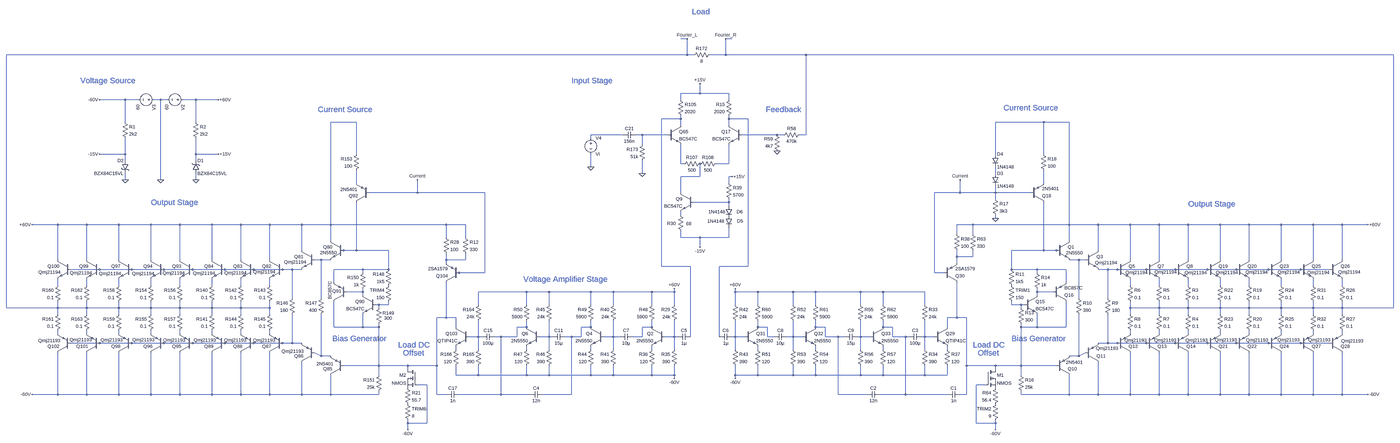
[diagram p0: schematic paltkz - Copy.asc, whole sheet]
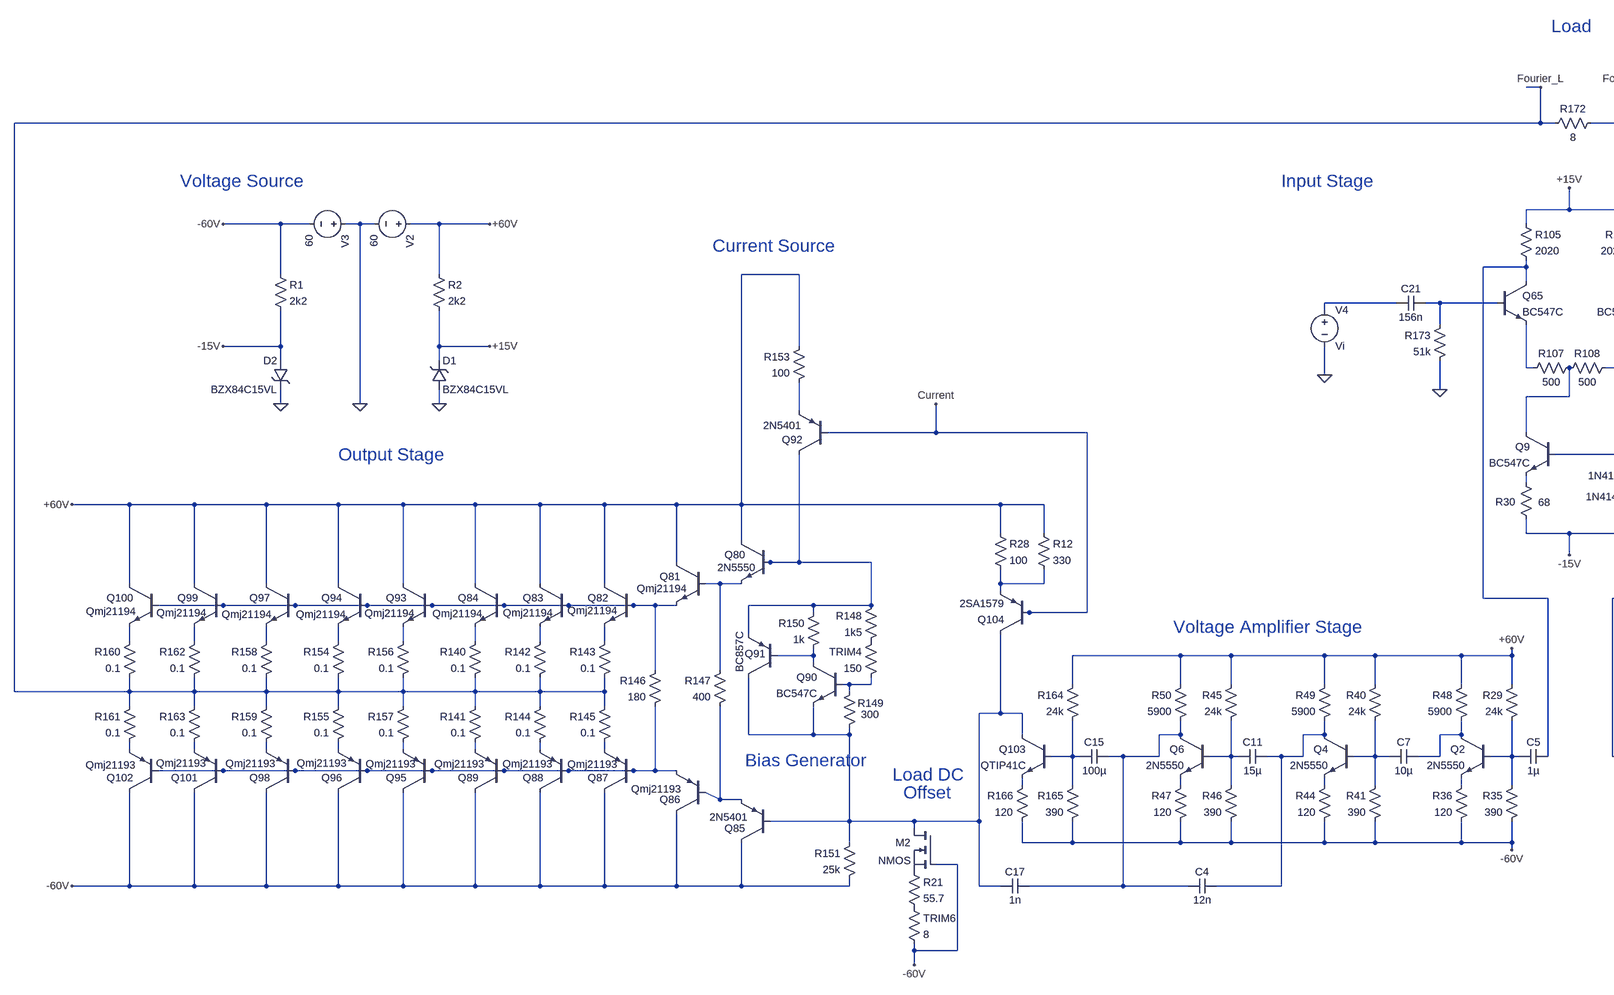
[diagram p1: schematic paltkz - Copy.asc, part, row 1 of 1, column 1 of 2]
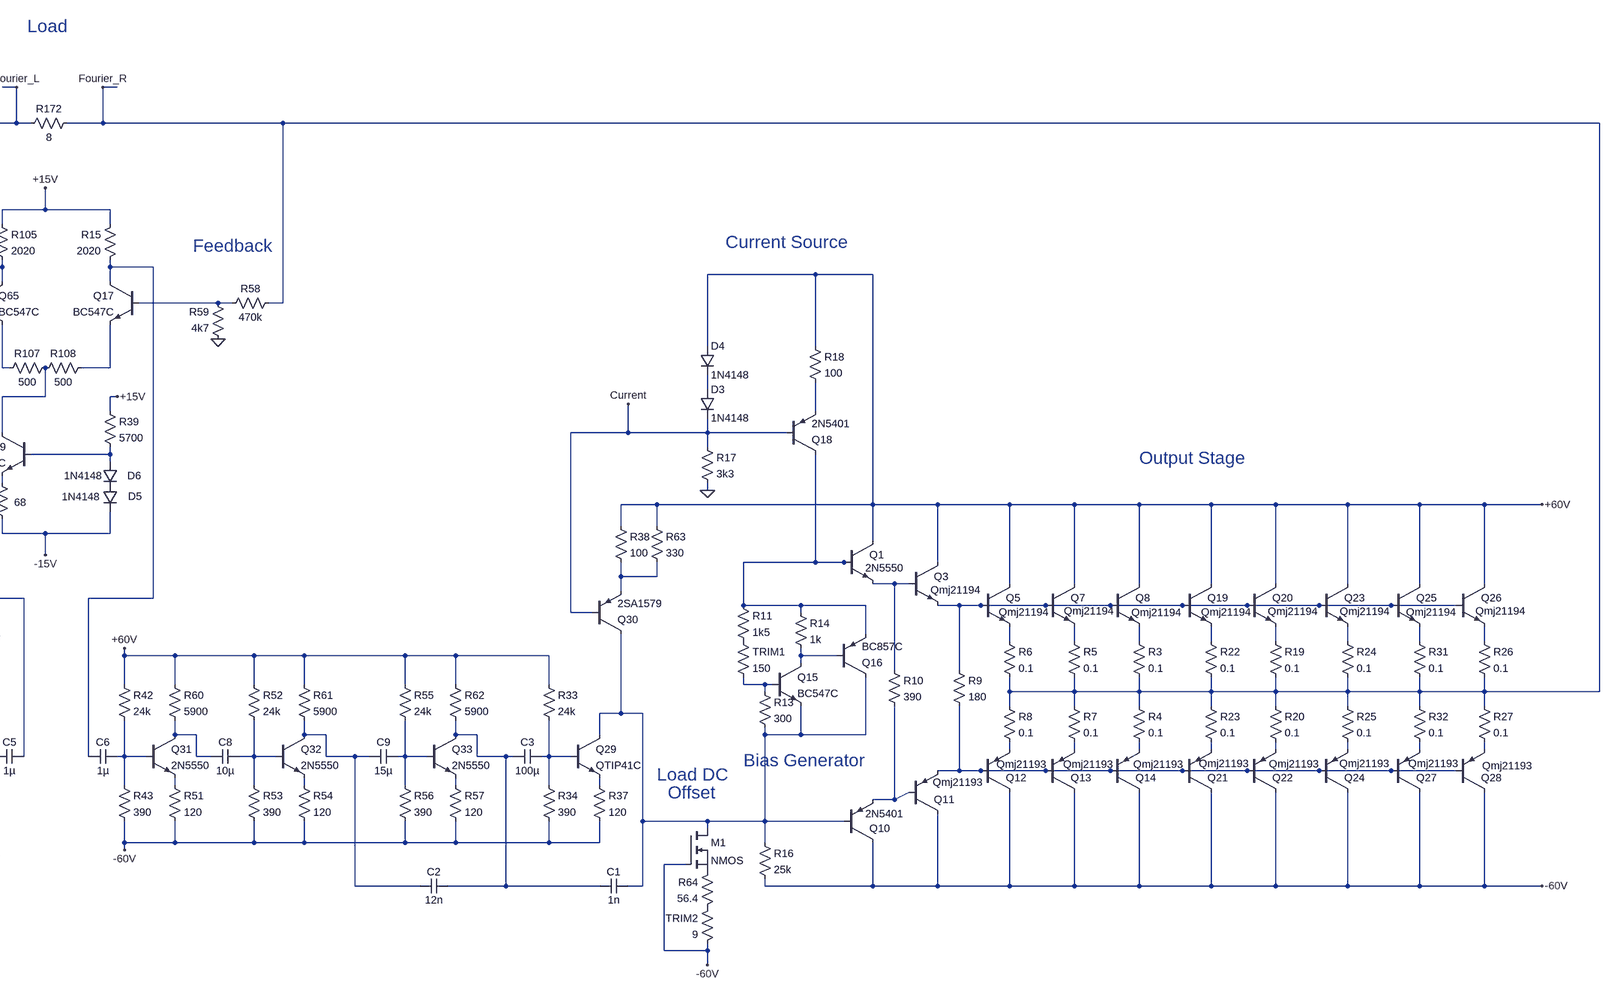
[diagram p2: schematic paltkz - Copy.asc, part, row 1 of 1, column 2 of 2]
paltkz - Copy.asc, the LTspice schematic file:
Version 4
SHEET 1 16980 7664
WIRE 7696 4128 7664 4128
WIRE 7920 4128 7888 4128
WIRE 7696 4208 7696 4128
WIRE 7696 4208 4304 4208
WIRE 7728 4208 7696 4208
WIRE 7888 4208 7888 4128
WIRE 7888 4208 7808 4208
WIRE 8288 4208 7888 4208
WIRE 11216 4208 8288 4208
WIRE 7760 4400 7760 4352
WIRE 7760 4400 7664 4400
WIRE 7904 4400 7760 4400
WIRE 4896 4432 4768 4432
WIRE 4960 4432 4896 4432
WIRE 5072 4432 5040 4432
WIRE 5104 4432 5072 4432
WIRE 5248 4432 5184 4432
WIRE 5360 4432 5248 4432
WIRE 7664 4432 7664 4400
WIRE 7904 4432 7904 4400
WIRE 7664 4528 7664 4512
WIRE 7664 4528 7568 4528
WIRE 7904 4528 7904 4512
WIRE 8000 4528 7904 4528
WIRE 4896 4544 4896 4432
WIRE 5248 4544 5248 4432
WIRE 6048 4544 5920 4544
WIRE 9472 4544 9232 4544
WIRE 9600 4544 9472 4544
WIRE 7664 4560 7664 4528
WIRE 7904 4560 7904 4528
WIRE 7376 4608 7216 4608
WIRE 7472 4608 7440 4608
WIRE 7600 4608 7472 4608
WIRE 8144 4608 7968 4608
WIRE 8176 4608 8144 4608
WIRE 8288 4608 8288 4208
WIRE 8288 4608 8256 4608
WIRE 7216 4624 7216 4608
WIRE 7472 4656 7472 4608
WIRE 4896 4704 4896 4624
WIRE 4896 4704 4768 4704
WIRE 5248 4704 5248 4624
WIRE 5360 4704 5248 4704
WIRE 6048 4704 6048 4544
WIRE 9232 4704 9232 4544
WIRE 9472 4704 9472 4544
WIRE 4896 4736 4896 4704
WIRE 5248 4736 5248 4704
WIRE 7664 4752 7664 4656
WIRE 7680 4752 7664 4752
WIRE 7904 4752 7904 4656
WIRE 7904 4752 7840 4752
WIRE 7216 4768 7216 4704
WIRE 7472 4800 7472 4736
WIRE 9232 4800 9232 4768
WIRE 7760 4816 7760 4752
WIRE 7760 4816 7664 4816
WIRE 7920 4816 7904 4816
WIRE 4896 4832 4896 4800
WIRE 5072 4832 5072 4432
WIRE 5248 4832 5248 4800
WIRE 6048 4848 6048 4784
WIRE 7904 4848 7904 4816
WIRE 9472 4848 9472 4784
WIRE 6352 4896 6352 4832
WIRE 6352 4896 6112 4896
WIRE 6688 4896 6352 4896
WIRE 7664 4896 7664 4816
WIRE 9056 4896 9056 4832
WIRE 9056 4896 8928 4896
WIRE 9232 4896 9232 4864
WIRE 9232 4896 9056 4896
WIRE 9408 4896 9232 4896
WIRE 9232 4928 9232 4896
WIRE 7904 4944 7904 4928
WIRE 7904 4944 7728 4944
WIRE 7904 4960 7904 4944
WIRE 7664 5008 7664 4992
WIRE 7904 5024 7904 5008
WIRE 9232 5024 9232 5008
WIRE 4560 5056 4432 5056
WIRE 4704 5056 4560 5056
WIRE 4864 5056 4704 5056
WIRE 5024 5056 4864 5056
WIRE 5168 5056 5024 5056
WIRE 5328 5056 5168 5056
WIRE 5472 5056 5328 5056
WIRE 5616 5056 5472 5056
WIRE 5776 5056 5616 5056
WIRE 5920 5056 5920 4544
WIRE 5920 5056 5776 5056
WIRE 6496 5056 5920 5056
WIRE 6592 5056 6496 5056
WIRE 9120 5056 9040 5056
WIRE 9600 5056 9600 4544
WIRE 9600 5056 9120 5056
WIRE 9744 5056 9600 5056
WIRE 9904 5056 9744 5056
WIRE 10048 5056 9904 5056
WIRE 10192 5056 10048 5056
WIRE 10352 5056 10192 5056
WIRE 10496 5056 10352 5056
WIRE 10656 5056 10496 5056
WIRE 10816 5056 10656 5056
WIRE 10960 5056 10816 5056
WIRE 11088 5056 10960 5056
WIRE 9040 5104 9040 5056
WIRE 9120 5104 9120 5056
WIRE 6496 5120 6496 5056
WIRE 6592 5120 6592 5056
WIRE 7664 5120 7664 5088
WIRE 7760 5120 7664 5120
WIRE 7904 5120 7904 5072
WIRE 7904 5120 7760 5120
WIRE 5920 5136 5920 5056
WIRE 9600 5136 9600 5056
WIRE 7760 5168 7760 5120
WIRE 5776 5184 5776 5056
WIRE 5984 5184 5968 5184
WIRE 6048 5184 6048 4944
WIRE 6048 5184 5984 5184
WIRE 6208 5184 6048 5184
WIRE 9472 5184 9472 4944
WIRE 9472 5184 9312 5184
WIRE 9536 5184 9472 5184
WIRE 9552 5184 9536 5184
WIRE 9744 5184 9744 5056
WIRE 9040 5216 9040 5184
WIRE 9120 5216 9120 5184
WIRE 9120 5216 9040 5216
WIRE 4560 5232 4560 5056
WIRE 4704 5232 4704 5056
WIRE 4864 5232 4864 5056
WIRE 5024 5232 5024 5056
WIRE 5168 5232 5168 5056
WIRE 5328 5232 5328 5056
WIRE 5472 5232 5472 5056
WIRE 5616 5232 5616 5056
WIRE 5872 5232 5840 5232
WIRE 5920 5232 5872 5232
WIRE 6496 5232 6496 5200
WIRE 6592 5232 6592 5200
WIRE 6592 5232 6496 5232
WIRE 9648 5232 9600 5232
WIRE 9680 5232 9648 5232
WIRE 9904 5232 9904 5056
WIRE 10048 5232 10048 5056
WIRE 10192 5232 10192 5056
WIRE 10352 5232 10352 5056
WIRE 10496 5232 10496 5056
WIRE 10656 5232 10656 5056
WIRE 10816 5232 10816 5056
WIRE 10960 5232 10960 5056
WIRE 6496 5248 6496 5232
WIRE 9040 5248 9040 5216
WIRE 7568 5264 7568 4528
WIRE 7712 5264 7568 5264
WIRE 8000 5264 8000 4528
WIRE 8000 5264 7856 5264
WIRE 4768 5280 4624 5280
WIRE 4928 5280 4768 5280
WIRE 5088 5280 4928 5280
WIRE 5232 5280 5088 5280
WIRE 5392 5280 5232 5280
WIRE 5536 5280 5392 5280
WIRE 5680 5280 5536 5280
WIRE 5728 5280 5680 5280
WIRE 5776 5280 5728 5280
WIRE 6080 5280 5936 5280
WIRE 6208 5280 6208 5184
WIRE 6208 5280 6080 5280
WIRE 9312 5280 9312 5184
WIRE 9440 5280 9312 5280
WIRE 9584 5280 9440 5280
WIRE 9792 5280 9744 5280
WIRE 9840 5280 9792 5280
WIRE 9984 5280 9840 5280
WIRE 10128 5280 9984 5280
WIRE 10288 5280 10128 5280
WIRE 10432 5280 10288 5280
WIRE 10592 5280 10432 5280
WIRE 10752 5280 10592 5280
WIRE 10896 5280 10752 5280
WIRE 6080 5296 6080 5280
WIRE 6560 5296 6544 5296
WIRE 6688 5296 6688 4896
WIRE 6688 5296 6560 5296
WIRE 8928 5296 8928 4896
WIRE 8976 5296 8928 5296
WIRE 9440 5296 9440 5280
WIRE 5936 5344 5936 5280
WIRE 9584 5344 9584 5280
WIRE 4560 5360 4560 5328
WIRE 4704 5360 4704 5328
WIRE 4864 5360 4864 5328
WIRE 5024 5360 5024 5328
WIRE 5168 5360 5168 5328
WIRE 5328 5360 5328 5328
WIRE 5472 5360 5472 5328
WIRE 5616 5360 5616 5328
WIRE 9904 5360 9904 5328
WIRE 10048 5360 10048 5328
WIRE 10192 5360 10192 5328
WIRE 10352 5360 10352 5328
WIRE 10496 5360 10496 5328
WIRE 10656 5360 10656 5328
WIRE 10816 5360 10816 5328
WIRE 10960 5360 10960 5328
WIRE 6080 5392 6080 5376
WIRE 6080 5392 6000 5392
WIRE 6896 5392 6656 5392
WIRE 7008 5392 6896 5392
WIRE 7216 5392 7008 5392
WIRE 7328 5392 7216 5392
WIRE 7520 5392 7328 5392
WIRE 7632 5392 7632 5376
WIRE 7632 5392 7520 5392
WIRE 7936 5392 7936 5376
WIRE 8048 5392 7936 5392
WIRE 8224 5392 8048 5392
WIRE 8336 5392 8224 5392
WIRE 8560 5392 8336 5392
WIRE 8672 5392 8560 5392
WIRE 8880 5392 8672 5392
WIRE 9440 5392 9440 5376
WIRE 9520 5392 9440 5392
WIRE 6080 5408 6080 5392
WIRE 9440 5408 9440 5392
WIRE 5728 5424 5728 5280
WIRE 5872 5424 5872 5232
WIRE 9648 5424 9648 5232
WIRE 9792 5424 9792 5280
WIRE 6160 5456 6144 5456
WIRE 6208 5456 6208 5440
WIRE 6208 5456 6160 5456
WIRE 6656 5456 6656 5392
WIRE 6896 5456 6896 5392
WIRE 7008 5456 7008 5392
WIRE 7216 5456 7216 5392
WIRE 7328 5456 7328 5392
WIRE 7520 5456 7520 5392
WIRE 7632 5456 7632 5392
WIRE 7936 5456 7936 5392
WIRE 8048 5456 8048 5392
WIRE 8224 5456 8224 5392
WIRE 8336 5456 8336 5392
WIRE 8560 5456 8560 5392
WIRE 8672 5456 8672 5392
WIRE 8880 5456 8880 5392
WIRE 9312 5456 9312 5440
WIRE 9360 5456 9312 5456
WIRE 9376 5456 9360 5456
WIRE 4304 5472 4304 4208
WIRE 4560 5472 4560 5440
WIRE 4560 5472 4304 5472
WIRE 4704 5472 4704 5440
WIRE 4704 5472 4560 5472
WIRE 4864 5472 4864 5440
WIRE 4864 5472 4704 5472
WIRE 5024 5472 5024 5440
WIRE 5024 5472 4864 5472
WIRE 5168 5472 5168 5440
WIRE 5168 5472 5024 5472
WIRE 5328 5472 5328 5440
WIRE 5328 5472 5168 5472
WIRE 5472 5472 5472 5440
WIRE 5472 5472 5328 5472
WIRE 5616 5472 5616 5440
WIRE 5616 5472 5472 5472
WIRE 6160 5472 6160 5456
WIRE 9360 5472 9360 5456
WIRE 9904 5472 9904 5440
WIRE 10048 5472 10048 5440
WIRE 10048 5472 9904 5472
WIRE 10192 5472 10192 5440
WIRE 10192 5472 10048 5472
WIRE 10352 5472 10352 5440
WIRE 10352 5472 10192 5472
WIRE 10496 5472 10496 5440
WIRE 10496 5472 10352 5472
WIRE 10656 5472 10656 5440
WIRE 10656 5472 10496 5472
WIRE 10816 5472 10816 5440
WIRE 10816 5472 10656 5472
WIRE 10960 5472 10960 5440
WIRE 10960 5472 10816 5472
WIRE 11216 5472 11216 4208
WIRE 11216 5472 10960 5472
WIRE 4560 5504 4560 5472
WIRE 4704 5504 4704 5472
WIRE 4864 5504 4864 5472
WIRE 5024 5504 5024 5472
WIRE 5168 5504 5168 5472
WIRE 5328 5504 5328 5472
WIRE 5472 5504 5472 5472
WIRE 5616 5504 5616 5472
WIRE 9904 5504 9904 5472
WIRE 10048 5504 10048 5472
WIRE 10192 5504 10192 5472
WIRE 10352 5504 10352 5472
WIRE 10496 5504 10496 5472
WIRE 10656 5504 10656 5472
WIRE 10816 5504 10816 5472
WIRE 10960 5504 10960 5472
WIRE 6496 5520 6496 5344
WIRE 6496 5520 6448 5520
WIRE 6544 5520 6496 5520
WIRE 9040 5520 9040 5344
WIRE 9040 5520 8992 5520
WIRE 9088 5520 9040 5520
WIRE 5936 5568 5936 5440
WIRE 6080 5568 6080 5504
WIRE 6080 5568 5936 5568
WIRE 6160 5568 6160 5552
WIRE 6160 5568 6080 5568
WIRE 6544 5568 6544 5520
WIRE 6896 5568 6896 5536
WIRE 6896 5568 6848 5568
WIRE 7216 5568 7216 5536
WIRE 7216 5568 7168 5568
WIRE 7520 5568 7520 5536
WIRE 7520 5568 7472 5568
WIRE 8048 5568 8048 5536
WIRE 8096 5568 8048 5568
WIRE 8336 5568 8336 5536
WIRE 8384 5568 8336 5568
WIRE 8672 5568 8672 5536
WIRE 8720 5568 8672 5568
WIRE 8992 5568 8992 5520
WIRE 9360 5568 9360 5552
WIRE 9440 5568 9440 5504
WIRE 9440 5568 9360 5568
WIRE 9584 5568 9584 5440
WIRE 9584 5568 9440 5568
WIRE 4560 5600 4560 5584
WIRE 4704 5600 4704 5584
WIRE 4864 5600 4864 5584
WIRE 5024 5600 5024 5584
WIRE 5168 5600 5168 5584
WIRE 5328 5600 5328 5584
WIRE 5472 5600 5472 5584
WIRE 5616 5600 5616 5584
WIRE 9904 5600 9904 5584
WIRE 10048 5600 10048 5584
WIRE 10192 5600 10192 5584
WIRE 10352 5600 10352 5584
WIRE 10496 5600 10496 5584
WIRE 10656 5600 10656 5584
WIRE 10816 5600 10816 5584
WIRE 10960 5600 10960 5584
WIRE 6656 5616 6656 5536
WIRE 6656 5616 6608 5616
WIRE 6672 5616 6656 5616
WIRE 6768 5616 6736 5616
WIRE 6848 5616 6848 5568
WIRE 6848 5616 6768 5616
WIRE 7008 5616 7008 5536
WIRE 7008 5616 6960 5616
WIRE 7024 5616 7008 5616
WIRE 7120 5616 7088 5616
WIRE 7168 5616 7168 5568
WIRE 7168 5616 7120 5616
WIRE 7328 5616 7328 5536
WIRE 7328 5616 7280 5616
WIRE 7360 5616 7328 5616
WIRE 7472 5616 7472 5568
WIRE 7472 5616 7424 5616
WIRE 7632 5616 7632 5536
WIRE 7632 5616 7584 5616
WIRE 7648 5616 7632 5616
WIRE 7712 5616 7712 5264
WIRE 7856 5616 7856 5264
WIRE 7936 5616 7936 5536
WIRE 7936 5616 7920 5616
WIRE 7984 5616 7936 5616
WIRE 8096 5616 8096 5568
WIRE 8128 5616 8096 5616
WIRE 8224 5616 8224 5536
WIRE 8224 5616 8192 5616
WIRE 8272 5616 8224 5616
WIRE 8384 5616 8384 5568
WIRE 8448 5616 8384 5616
WIRE 8480 5616 8448 5616
WIRE 8560 5616 8560 5536
WIRE 8560 5616 8544 5616
WIRE 8608 5616 8560 5616
WIRE 8720 5616 8720 5568
WIRE 8784 5616 8720 5616
WIRE 8800 5616 8784 5616
WIRE 8880 5616 8880 5536
WIRE 8880 5616 8864 5616
WIRE 8928 5616 8880 5616
WIRE 4768 5648 4624 5648
WIRE 4928 5648 4768 5648
WIRE 5088 5648 4928 5648
WIRE 5232 5648 5088 5648
WIRE 5392 5648 5232 5648
WIRE 5536 5648 5392 5648
WIRE 5680 5648 5536 5648
WIRE 5728 5648 5728 5504
WIRE 5728 5648 5680 5648
WIRE 5776 5648 5728 5648
WIRE 9792 5648 9792 5504
WIRE 9792 5648 9744 5648
WIRE 9840 5648 9792 5648
WIRE 9984 5648 9840 5648
WIRE 10128 5648 9984 5648
WIRE 10288 5648 10128 5648
WIRE 10432 5648 10288 5648
WIRE 10592 5648 10432 5648
WIRE 10752 5648 10592 5648
WIRE 10896 5648 10752 5648
WIRE 6544 5680 6544 5664
WIRE 6656 5680 6656 5616
WIRE 6896 5680 6896 5664
WIRE 7008 5680 7008 5616
WIRE 7216 5680 7216 5664
WIRE 7328 5680 7328 5616
WIRE 7520 5680 7520 5664
WIRE 7632 5680 7632 5616
WIRE 7936 5680 7936 5616
WIRE 8048 5680 8048 5664
WIRE 8224 5680 8224 5616
WIRE 8336 5680 8336 5664
WIRE 8560 5680 8560 5616
WIRE 8672 5680 8672 5664
WIRE 8880 5680 8880 5616
WIRE 8992 5680 8992 5664
WIRE 5872 5712 5872 5504
WIRE 5872 5712 5840 5696
WIRE 5920 5712 5872 5712
WIRE 9648 5712 9648 5504
WIRE 9648 5712 9680 5696
WIRE 9648 5712 9600 5712
WIRE 6160 5760 6160 5568
WIRE 6160 5760 5984 5760
WIRE 6304 5760 6160 5760
WIRE 6448 5760 6448 5520
WIRE 6448 5760 6304 5760
WIRE 9088 5760 9088 5520
WIRE 9232 5760 9088 5760
WIRE 9360 5760 9360 5568
WIRE 9360 5760 9232 5760
WIRE 9536 5760 9360 5760
WIRE 6304 5776 6304 5760
WIRE 9232 5776 9232 5760
WIRE 6160 5808 6160 5760
WIRE 6544 5808 6544 5760
WIRE 6656 5808 6656 5760
WIRE 6656 5808 6544 5808
WIRE 6896 5808 6896 5760
WIRE 6896 5808 6656 5808
WIRE 7008 5808 7008 5760
WIRE 7008 5808 6896 5808
WIRE 7216 5808 7216 5760
WIRE 7216 5808 7008 5808
WIRE 7328 5808 7328 5760
WIRE 7328 5808 7216 5808
WIRE 7520 5808 7520 5760
WIRE 7520 5808 7328 5808
WIRE 7632 5808 7632 5760
WIRE 7632 5808 7520 5808
WIRE 7936 5808 7936 5760
WIRE 8048 5808 8048 5760
WIRE 8048 5808 7936 5808
WIRE 8224 5808 8224 5760
WIRE 8224 5808 8048 5808
WIRE 8336 5808 8336 5760
WIRE 8336 5808 8224 5808
WIRE 8560 5808 8560 5760
WIRE 8560 5808 8336 5808
WIRE 8672 5808 8672 5760
WIRE 8672 5808 8560 5808
WIRE 8880 5808 8880 5760
WIRE 8880 5808 8672 5808
WIRE 8992 5808 8992 5760
WIRE 8992 5808 8880 5808
WIRE 9360 5808 9360 5760
WIRE 7632 5824 7632 5808
WIRE 7936 5824 7936 5808
WIRE 6400 5856 6352 5856
WIRE 9184 5856 9136 5856
WIRE 4560 5904 4560 5696
WIRE 4560 5904 4432 5904
WIRE 4704 5904 4704 5696
WIRE 4704 5904 4560 5904
WIRE 4864 5904 4864 5696
WIRE 4864 5904 4704 5904
WIRE 5024 5904 5024 5696
WIRE 5024 5904 4864 5904
WIRE 5168 5904 5168 5696
WIRE 5168 5904 5024 5904
WIRE 5328 5904 5328 5696
WIRE 5328 5904 5168 5904
WIRE 5472 5904 5472 5696
WIRE 5472 5904 5328 5904
WIRE 5616 5904 5616 5696
WIRE 5616 5904 5472 5904
WIRE 5776 5904 5776 5744
WIRE 5776 5904 5616 5904
WIRE 5920 5904 5920 5808
WIRE 5920 5904 5776 5904
WIRE 6160 5904 6160 5888
WIRE 6160 5904 5920 5904
WIRE 6448 5904 6448 5760
WIRE 6496 5904 6448 5904
WIRE 6768 5904 6768 5616
WIRE 6768 5904 6560 5904
WIRE 6912 5904 6768 5904
WIRE 7120 5904 7120 5616
WIRE 7120 5904 6976 5904
WIRE 8448 5904 8448 5616
WIRE 8592 5904 8448 5904
WIRE 8784 5904 8784 5616
WIRE 8784 5904 8656 5904
WIRE 8992 5904 8784 5904
WIRE 9088 5904 9088 5760
WIRE 9088 5904 9056 5904
WIRE 9360 5904 9360 5888
WIRE 9600 5904 9600 5808
WIRE 9600 5904 9360 5904
WIRE 9744 5904 9744 5744
WIRE 9744 5904 9600 5904
WIRE 9904 5904 9904 5696
WIRE 9904 5904 9744 5904
WIRE 10048 5904 10048 5696
WIRE 10048 5904 9904 5904
WIRE 10192 5904 10192 5696
WIRE 10192 5904 10048 5904
WIRE 10352 5904 10352 5696
WIRE 10352 5904 10192 5904
WIRE 10496 5904 10496 5696
WIRE 10496 5904 10352 5904
WIRE 10656 5904 10656 5696
WIRE 10656 5904 10496 5904
WIRE 10816 5904 10816 5696
WIRE 10816 5904 10656 5904
WIRE 10960 5904 10960 5696
WIRE 10960 5904 10816 5904
WIRE 11088 5904 10960 5904
WIRE 6304 6048 6304 6032
WIRE 6400 6048 6400 5856
WIRE 6400 6048 6304 6048
WIRE 9136 6048 9136 5856
WIRE 9232 6048 9232 6032
WIRE 9232 6048 9136 6048
WIRE 6304 6080 6304 6048
WIRE 9232 6080 9232 6048
FLAG 5072 4832 0
FLAG 5360 4432 +60V
FLAG 4768 4432 -60V
FLAG 7760 4352 +15V
FLAG 4432 5904 -60V
FLAG 4432 5056 +60V
FLAG 7216 4768 0
FLAG 7472 4800 0
FLAG 5248 4832 0
FLAG 4896 4832 0
FLAG 5360 4704 +15V
FLAG 4768 4704 -15V
FLAG 7696 4128 Fourier_L
FLAG 7760 5168 -15V
FLAG 7632 5376 +60V
FLAG 7632 5824 -60V
FLAG 6352 4832 Current
FLAG 6304 6080 -60V
FLAG 9232 5024 0
FLAG 11088 5904 -60V
FLAG 11088 5056 +60V
FLAG 7888 4128 Fourier_R
FLAG 7920 4816 +15V
FLAG 7936 5376 +60V
FLAG 7936 5824 -60V
FLAG 8144 4688 0
FLAG 9056 4832 Current
FLAG 9232 6080 -60V
SYMBOL voltage 5200 4432 R90
WINDOW 123 0 0 Left 0
WINDOW 39 24 44 Left 2
SYMATTR InstName V2
SYMATTR Value 60
SYMBOL voltage 5056 4432 R90
WINDOW 123 0 0 Left 0
WINDOW 39 24 124 Left 2
SYMATTR InstName V3
SYMATTR Value 60
SYMBOL npn 7600 4560 R0
SYMATTR InstName Q65
SYMATTR Value BC547C
SYMBOL res 7648 4416 R0
SYMATTR InstName R105
SYMATTR Value 2020
SYMBOL res 7776 4736 R90
WINDOW 0 0 56 VBottom 2
WINDOW 3 32 56 VTop 2
SYMATTR InstName R107
SYMATTR Value 500
SYMBOL res 7856 4736 R90
WINDOW 0 0 56 VBottom 2
WINDOW 3 32 56 VTop 2
SYMATTR InstName R108
SYMATTR Value 500
SYMBOL npn 5984 5136 M0
WINDOW 3 33 60 Left 2
SYMATTR Value 2N5550
SYMATTR InstName Q80
SYMBOL npn 5840 5184 M0
WINDOW 3 41 59 Left 2
SYMATTR Value Qmj21194
SYMATTR InstName Q81
SYMBOL npn 5680 5232 M0
WINDOW 3 35 60 Left 2
SYMATTR Value Qmj21194
SYMATTR InstName Q82
SYMBOL npn 5536 5232 M0
WINDOW 3 34 65 Left 2
SYMATTR Value Qmj21194
SYMATTR InstName Q83
SYMBOL npn 5392 5232 M0
WINDOW 3 47 67 Left 2
SYMATTR Value Qmj21194
SYMATTR InstName Q84
SYMBOL pnp 5984 5808 R180
WINDOW 3 50 57 Left 2
SYMATTR Value 2N5401
SYMATTR InstName Q85
SYMBOL pnp 5840 5744 R180
WINDOW 3 53 55 Left 2
SYMATTR Value Qmj21193
SYMATTR InstName Q86
SYMBOL pnp 5680 5696 R180
WINDOW 3 35 62 Left 2
SYMATTR Value Qmj21193
SYMATTR InstName Q87
SYMBOL pnp 5536 5696 R180
WINDOW 3 35 63 Left 2
SYMATTR Value Qmj21193
SYMATTR InstName Q88
SYMBOL pnp 5392 5696 R180
WINDOW 3 43 63 Left 2
SYMATTR Value Qmj21193
SYMATTR InstName Q89
SYMBOL res 5344 5344 M0
SYMATTR InstName R140
SYMATTR Value 0.1
SYMBOL res 5344 5488 M0
SYMATTR InstName R141
SYMATTR Value 0.1
SYMBOL res 5488 5344 M0
SYMATTR InstName R142
SYMATTR Value 0.1
SYMBOL res 5632 5344 M0
SYMATTR InstName R143
SYMATTR Value 0.1
SYMBOL res 5488 5488 M0
SYMATTR InstName R144
SYMATTR Value 0.1
SYMBOL res 5632 5488 M0
SYMATTR InstName R145
SYMATTR Value 0.1
SYMBOL res 5744 5408 M0
SYMATTR InstName R146
SYMATTR Value 180
SYMBOL res 5888 5408 M0
SYMATTR InstName R147
SYMATTR Value 400
SYMBOL npn 6144 5408 M0
SYMATTR InstName Q90
SYMATTR Value BC547C
SYMBOL res 6224 5264 M0
SYMATTR InstName R148
SYMATTR Value 1k5
SYMBOL res 6176 5456 M0
WINDOW 0 -60 42 Left 2
WINDOW 3 -50 67 Left 2
SYMATTR InstName R149
SYMATTR Value 300
SYMBOL res 6096 5280 M0
SYMATTR InstName R150
SYMATTR Value 1k
SYMBOL pnp 6000 5440 R180
WINDOW 0 27 52 Left 2
WINDOW 3 84 11 VRight 2
SYMATTR InstName Q91
SYMATTR Value BC857C
SYMBOL res 6176 5792 M0
SYMATTR InstName R151
SYMATTR Value 25k
SYMBOL pnp 6112 4944 R180
WINDOW 3 59 64 Left 2
SYMATTR Value 2N5401
SYMATTR InstName Q92
SYMBOL res 6064 4688 M0
SYMATTR InstName R153
SYMATTR Value 100
SYMBOL npn 5232 5232 M0
WINDOW 3 38 66 Left 2
SYMATTR Value Qmj21194
SYMATTR InstName Q93
SYMBOL npn 5088 5232 M0
WINDOW 3 46 68 Left 2
SYMATTR Value Qmj21194
SYMATTR InstName Q94
SYMBOL pnp 5232 5696 R180
WINDOW 3 35 63 Left 2
SYMATTR Value Qmj21193
SYMATTR InstName Q95
SYMBOL pnp 5088 5696 R180
WINDOW 3 45 65 Left 2
SYMATTR Value Qmj21193
SYMATTR InstName Q96
SYMBOL res 5040 5344 M0
SYMATTR InstName R154
SYMATTR Value 0.1
SYMBOL res 5040 5488 M0
SYMATTR InstName R155
SYMATTR Value 0.1
SYMBOL res 5184 5344 M0
SYMATTR InstName R156
SYMATTR Value 0.1
SYMBOL res 5184 5488 M0
SYMATTR InstName R157
SYMATTR Value 0.1
SYMBOL npn 4928 5232 M0
WINDOW 3 51 68 Left 2
SYMATTR Value Qmj21194
SYMATTR InstName Q97
SYMBOL pnp 4928 5696 R180
WINDOW 3 43 64 Left 2
SYMATTR Value Qmj21193
SYMATTR InstName Q98
SYMBOL res 4880 5344 M0
SYMATTR InstName R158
SYMATTR Value 0.1
SYMBOL res 4880 5488 M0
SYMATTR InstName R159
SYMATTR Value 0.1
SYMBOL npn 4768 5232 M0
WINDOW 3 36 65 Left 2
SYMATTR Value Qmj21194
SYMATTR InstName Q99
SYMBOL npn 4624 5232 M0
WINDOW 3 49 62 Left 2
SYMATTR Value Qmj21194
SYMATTR InstName Q100
SYMBOL pnp 4768 5696 R180
WINDOW 3 37 65 Left 2
SYMATTR Value Qmj21193
SYMATTR InstName Q101
SYMBOL pnp 4624 5696 R180
WINDOW 3 50 61 Left 2
SYMATTR Value Qmj21193
SYMATTR InstName Q102
SYMBOL res 4576 5344 M0
SYMATTR InstName R160
SYMATTR Value 0.1
SYMBOL res 4576 5488 M0
SYMATTR InstName R161
SYMATTR Value 0.1
SYMBOL res 4720 5344 M0
SYMATTR InstName R162
SYMATTR Value 0.1
SYMBOL res 4720 5488 M0
SYMATTR InstName R163
SYMATTR Value 0.1
SYMBOL res 6672 5440 M0
SYMATTR InstName R164
SYMATTR Value 24k
SYMBOL res 6672 5664 M0
SYMATTR InstName R165
SYMATTR Value 390
SYMBOL npn 6608 5568 M0
SYMATTR InstName Q103
SYMATTR Value QTIP41C
SYMBOL res 6560 5664 M0
SYMATTR InstName R166
SYMATTR Value 120
SYMBOL pnp 6560 5344 R180
SYMATTR InstName Q104
SYMATTR Value 2SA1579
SYMBOL cap 6496 5888 M90
WINDOW 0 0 32 VBottom 2
WINDOW 3 32 32 VTop 2
SYMATTR InstName C17
SYMATTR Value 1n
SYMATTR SpiceLine Rser=0.1
SYMBOL voltage 7216 4608 R0
WINDOW 123 24 124 Left 2
WINDOW 39 0 0 Left 0
SYMATTR InstName V4
SYMATTR Value Vi
SYMBOL cap 7440 4592 R90
WINDOW 0 0 32 VBottom 2
WINDOW 3 32 32 VTop 2
SYMATTR InstName C21
SYMATTR Value 156n
SYMATTR SpiceLine Rser=0.1
SYMBOL res 7488 4640 M0
SYMATTR InstName R173
SYMATTR Value 51k
SYMBOL res 7824 4192 R90
WINDOW 0 0 56 VBottom 2
WINDOW 3 32 56 VTop 2
SYMATTR InstName R172
SYMATTR Value 8
SYMBOL zener 5232 4800 M180
WINDOW 0 24 64 Left 2
WINDOW 3 24 0 Left 2
SYMATTR InstName D1
SYMATTR Value BZX84C15VL
SYMBOL zener 4912 4736 M0
SYMATTR InstName D2
SYMATTR Value BZX84C15VL
SYMBOL npn 7728 4896 M0
SYMATTR InstName Q9
SYMATTR Value BC547C
SYMBOL res 7648 4992 R0
WINDOW 0 -52 58 Left 2
WINDOW 3 43 59 Left 2
SYMATTR InstName R30
SYMATTR Value 68
SYMBOL res 6480 5104 R0
SYMATTR InstName R28
SYMATTR Value 100
SYMBOL cap 6672 5600 M90
WINDOW 0 0 32 VBottom 2
WINDOW 3 32 32 VTop 2
SYMATTR InstName C15
SYMATTR Value 100µ
SYMATTR SpiceLine Rser=0.1
SYMBOL res 7648 5440 M0
SYMATTR InstName R29
SYMATTR Value 24k
SYMBOL res 7648 5664 M0
SYMATTR InstName R35
SYMATTR Value 390
SYMBOL npn 7584 5568 M0
SYMATTR InstName Q2
SYMATTR Value 2N5550
SYMBOL res 7536 5664 M0
SYMATTR InstName R36
SYMATTR Value 120
SYMBOL res 7344 5440 M0
SYMATTR InstName R40
SYMATTR Value 24k
SYMBOL res 7344 5664 M0
SYMATTR InstName R41
SYMATTR Value 390
SYMBOL npn 7280 5568 M0
SYMATTR InstName Q4
SYMATTR Value 2N5550
SYMBOL res 7232 5664 M0
SYMATTR InstName R44
SYMATTR Value 120
SYMBOL res 7024 5440 M0
SYMATTR InstName R45
SYMATTR Value 24k
SYMBOL res 7024 5664 M0
SYMATTR InstName R46
SYMATTR Value 390
SYMBOL npn 6960 5568 M0
SYMATTR InstName Q6
SYMATTR Value 2N5550
SYMBOL res 6912 5664 M0
SYMATTR InstName R47
SYMATTR Value 120
SYMBOL res 7536 5440 M0
SYMATTR InstName R48
SYMATTR Value 5900
SYMBOL res 7232 5440 M0
SYMATTR InstName R49
SYMATTR Value 5900
SYMBOL res 6912 5440 M0
SYMATTR InstName R50
SYMATTR Value 5900
SYMBOL cap 6976 5888 R90
WINDOW 0 0 32 VBottom 2
WINDOW 3 32 32 VTop 2
SYMATTR InstName C4
SYMATTR Value 12n
SYMATTR SpiceLine Rser=0.1
SYMBOL cap 7648 5600 M90
WINDOW 0 0 32 VBottom 2
WINDOW 3 32 32 VTop 2
SYMATTR InstName C5
SYMATTR Value 1µ
SYMBOL cap 7360 5600 M90
WINDOW 0 0 32 VBottom 2
WINDOW 3 32 32 VTop 2
SYMATTR InstName C7
SYMATTR Value 10µ
SYMBOL cap 7024 5600 M90
WINDOW 0 0 32 VBottom 2
WINDOW 3 32 32 VTop 2
SYMATTR InstName C11
SYMATTR Value 15µ
SYMBOL res 6576 5104 R0
SYMATTR InstName R12
SYMATTR Value 330
SYMBOL res 6224 5344 M0
SYMATTR InstName TRIM4
SYMATTR Value 150
SYMBOL res 6288 5856 R0
SYMATTR InstName R21
SYMATTR Value 55.7
SYMBOL res 6288 5936 R0
SYMATTR InstName TRIM6
SYMATTR Value 8
SYMBOL res 4880 4528 R0
SYMATTR InstName R1
SYMATTR Value 2k2
SYMBOL res 5232 4528 R0
SYMATTR InstName R2
SYMATTR Value 2k2
SYMBOL nmos 6352 5776 M0
SYMATTR InstName M2
SYMBOL npn 9536 5136 R0
WINDOW 3 47 61 Left 2
SYMATTR Value 2N5550
SYMATTR InstName Q1
SYMBOL npn 9680 5184 R0
WINDOW 3 48 62 Left 2
SYMATTR Value Qmj21194
SYMATTR InstName Q3
SYMBOL npn 9840 5232 R0
WINDOW 3 40 63 Left 2
SYMATTR Value Qmj21194
SYMATTR InstName Q5
SYMBOL npn 9984 5232 R0
WINDOW 3 41 61 Left 2
SYMATTR Value Qmj21194
SYMATTR InstName Q7
SYMBOL npn 10128 5232 R0
WINDOW 3 47 64 Left 2
SYMATTR Value Qmj21194
SYMATTR InstName Q8
SYMBOL pnp 9536 5808 M180
WINDOW 3 47 64 Left 2
SYMATTR Value 2N5401
SYMATTR InstName Q10
SYMBOL pnp 9680 5744 M180
WINDOW 3 53 70 Left 2
SYMATTR Value Qmj21193
SYMATTR InstName Q11
SYMBOL pnp 9840 5696 M180
WINDOW 3 35 62 Left 2
SYMATTR Value Qmj21193
SYMATTR InstName Q12
SYMBOL pnp 9984 5696 M180
WINDOW 3 39 62 Left 2
SYMATTR Value Qmj21193
SYMATTR InstName Q13
SYMBOL pnp 10128 5696 M180
WINDOW 3 51 62 Left 2
SYMATTR Value Qmj21193
SYMATTR InstName Q14
SYMBOL res 10176 5344 R0
SYMATTR InstName R3
SYMATTR Value 0.1
SYMBOL res 10176 5488 R0
SYMATTR InstName R4
SYMATTR Value 0.1
SYMBOL res 10032 5344 R0
SYMATTR InstName R5
SYMATTR Value 0.1
SYMBOL res 9888 5344 R0
SYMATTR InstName R6
SYMATTR Value 0.1
SYMBOL res 10032 5488 R0
SYMATTR InstName R7
SYMATTR Value 0.1
SYMBOL res 9888 5488 R0
SYMATTR InstName R8
SYMATTR Value 0.1
SYMBOL res 9776 5408 R0
SYMATTR InstName R9
SYMATTR Value 180
SYMBOL res 9632 5408 R0
SYMATTR InstName R10
SYMATTR Value 390
SYMBOL npn 9376 5408 R0
SYMATTR InstName Q15
SYMATTR Value BC547C
SYMBOL res 9296 5264 R0
SYMATTR InstName R11
SYMATTR Value 1k5
SYMBOL res 9344 5456 R0
SYMATTR InstName R13
SYMATTR Value 300
SYMBOL res 9424 5280 R0
SYMATTR InstName R14
SYMATTR Value 1k
SYMBOL pnp 9520 5440 M180
SYMATTR InstName Q16
SYMATTR Value BC857C
SYMBOL npn 7968 4560 M0
SYMATTR InstName Q17
SYMATTR Value BC547C
SYMBOL res 7920 4416 M0
SYMATTR InstName R15
SYMATTR Value 2020
SYMBOL res 9344 5792 R0
SYMATTR InstName R16
SYMATTR Value 25k
SYMBOL pnp 9408 4944 M180
SYMATTR InstName Q18
SYMATTR Value 2N5401
SYMBOL res 9216 4912 R0
SYMATTR InstName R17
SYMATTR Value 3k3
SYMBOL diode 9216 4800 R0
SYMATTR InstName D3
SYMATTR Value 1N4148
SYMBOL diode 9216 4704 R0
SYMATTR InstName D4
SYMATTR Value 1N4148
SYMBOL res 9456 4688 R0
SYMATTR InstName R18
SYMATTR Value 100
SYMBOL npn 10288 5232 R0
WINDOW 3 42 63 Left 2
SYMATTR Value Qmj21194
SYMATTR InstName Q19
SYMBOL npn 10432 5232 R0
WINDOW 3 46 62 Left 2
SYMATTR Value Qmj21194
SYMATTR InstName Q20
SYMBOL pnp 10288 5696 M180
WINDOW 3 37 64 Left 2
SYMATTR Value Qmj21193
SYMATTR InstName Q21
SYMBOL pnp 10432 5696 M180
WINDOW 3 49 63 Left 2
SYMATTR Value Qmj21193
SYMATTR InstName Q22
SYMBOL res 10480 5344 R0
SYMATTR InstName R19
SYMATTR Value 0.1
SYMBOL res 10480 5488 R0
SYMATTR InstName R20
SYMATTR Value 0.1
SYMBOL res 10336 5344 R0
SYMATTR InstName R22
SYMATTR Value 0.1
SYMBOL res 10336 5488 R0
SYMATTR InstName R23
SYMATTR Value 0.1
SYMBOL npn 10592 5232 R0
WINDOW 3 46 62 Left 2
SYMATTR Value Qmj21194
SYMATTR InstName Q23
SYMBOL pnp 10592 5696 M180
WINDOW 3 45 64 Left 2
SYMATTR Value Qmj21193
SYMATTR InstName Q24
SYMBOL res 10640 5344 R0
SYMATTR InstName R24
SYMATTR Value 0.1
SYMBOL res 10640 5488 R0
SYMATTR InstName R25
SYMATTR Value 0.1
SYMBOL npn 10752 5232 R0
WINDOW 3 34 63 Left 2
SYMATTR Value Qmj21194
SYMATTR InstName Q25
SYMBOL npn 10896 5232 R0
WINDOW 3 44 61 Left 2
SYMATTR Value Qmj21194
SYMATTR InstName Q26
SYMBOL pnp 10752 5696 M180
WINDOW 3 39 64 Left 2
SYMATTR Value Qmj21193
SYMATTR InstName Q27
SYMBOL pnp 10896 5696 M180
WINDOW 3 59 59 Left 2
SYMATTR Value Qmj21193
SYMATTR InstName Q28
SYMBOL res 10944 5344 R0
SYMATTR InstName R26
SYMATTR Value 0.1
SYMBOL res 10944 5488 R0
SYMATTR InstName R27
SYMATTR Value 0.1
SYMBOL res 10800 5344 R0
SYMATTR InstName R31
SYMATTR Value 0.1
SYMBOL res 10800 5488 R0
SYMATTR InstName R32
SYMATTR Value 0.1
SYMBOL res 8864 5440 R0
SYMATTR InstName R33
SYMATTR Value 24k
SYMBOL res 8864 5664 R0
SYMATTR InstName R34
SYMATTR Value 390
SYMBOL npn 8928 5568 R0
SYMATTR InstName Q29
SYMATTR Value QTIP41C
SYMBOL res 8976 5664 R0
SYMATTR InstName R37
SYMATTR Value 120
SYMBOL pnp 8976 5344 M180
SYMATTR InstName Q30
SYMATTR Value 2SA1579
SYMBOL res 9024 5088 R0
SYMATTR InstName R38
SYMATTR Value 100
SYMBOL cap 9056 5888 R90
WINDOW 0 0 32 VBottom 2
WINDOW 3 32 32 VTop 2
SYMATTR InstName C1
SYMATTR Value 1n
SYMATTR SpiceLine Rser=0.1
SYMBOL diode 7920 5008 M0
WINDOW 0 -55 30 Left 2
WINDOW 3 39 31 Left 2
SYMATTR InstName D5
SYMATTR Value 1N4148
SYMBOL diode 7920 4960 M0
WINDOW 0 -53 32 Left 2
WINDOW 3 34 32 Left 2
SYMATTR InstName D6
SYMATTR Value 1N4148
SYMBOL res 7888 4832 R0
SYMATTR InstName R39
SYMATTR Value 5700
SYMBOL res 7920 5440 R0
SYMATTR InstName R42
SYMATTR Value 24k
SYMBOL res 7920 5664 R0
SYMATTR InstName R43
SYMATTR Value 390
SYMBOL npn 7984 5568 R0
SYMATTR InstName Q31
SYMATTR Value 2N5550
SYMBOL res 8032 5664 R0
SYMATTR InstName R51
SYMATTR Value 120
SYMBOL res 8208 5440 R0
SYMATTR InstName R52
SYMATTR Value 24k
SYMBOL res 8208 5664 R0
SYMATTR InstName R53
SYMATTR Value 390
SYMBOL npn 8272 5568 R0
SYMATTR InstName Q32
SYMATTR Value 2N5550
SYMBOL res 8320 5664 R0
SYMATTR InstName R54
SYMATTR Value 120
SYMBOL res 8544 5440 R0
SYMATTR InstName R55
SYMATTR Value 24k
SYMBOL res 8544 5664 R0
SYMATTR InstName R56
SYMATTR Value 390
SYMBOL npn 8608 5568 R0
SYMATTR InstName Q33
SYMATTR Value 2N5550
SYMBOL res 8656 5664 R0
SYMATTR InstName R57
SYMATTR Value 120
SYMBOL res 8272 4592 R90
WINDOW 0 0 56 VBottom 2
WINDOW 3 32 56 VTop 2
SYMATTR InstName R58
SYMATTR Value 470k
SYMBOL res 8160 4704 R180
WINDOW 0 36 76 Left 2
WINDOW 3 36 40 Left 2
SYMATTR InstName R59
SYMATTR Value 4k7
SYMBOL res 8032 5440 R0
SYMATTR InstName R60
SYMATTR Value 5900
SYMBOL res 8320 5440 R0
SYMATTR InstName R61
SYMATTR Value 5900
SYMBOL res 8656 5440 R0
SYMATTR InstName R62
SYMATTR Value 5900
SYMBOL cap 8592 5888 M90
WINDOW 0 0 32 VBottom 2
WINDOW 3 32 32 VTop 2
SYMATTR InstName C2
SYMATTR Value 12n
SYMATTR SpiceLine Rser=0.1
SYMBOL cap 8800 5600 M90
WINDOW 0 0 32 VBottom 2
WINDOW 3 32 32 VTop 2
SYMATTR InstName C3
SYMATTR Value 100µ
SYMATTR SpiceLine Rser=0.1
SYMBOL cap 7920 5600 R90
WINDOW 0 0 32 VBottom 2
WINDOW 3 32 32 VTop 2
SYMATTR InstName C6
SYMATTR Value 1µ
SYMBOL cap 8192 5600 R90
WINDOW 0 0 32 VBottom 2
WINDOW 3 32 32 VTop 2
SYMATTR InstName C8
SYMATTR Value 10µ
SYMBOL cap 8544 5600 R90
WINDOW 0 0 32 VBottom 2
WINDOW 3 32 32 VTop 2
SYMATTR InstName C9
SYMATTR Value 15µ
SYMBOL res 9104 5088 R0
SYMATTR InstName R63
SYMATTR Value 330
SYMBOL res 9296 5344 R0
SYMATTR InstName TRIM1
SYMATTR Value 150
SYMBOL res 9248 5856 M0
SYMATTR InstName R64
SYMATTR Value 56.4
SYMBOL res 9248 5936 M0
SYMATTR InstName TRIM2
SYMATTR Value 9
SYMBOL nmos 9184 5776 R0
SYMATTR InstName M1
TEXT 4672 4336 Left 4 ;Voltage Source
TEXT 6880 5328 Left 4 ;Voltage Amplifier Stage
TEXT 7120 4336 Left 4 ;Input Stage
TEXT 5024 4944 Left 4 ;Output Stage
TEXT 7720 3992 Left 4 ;Load
TEXT 5856 4480 Left 4 ;Current Source
TEXT 5928 5624 Left 4 ;Bias Generator
TEXT 6256 5656 Left 4 ;Load DC
TEXT 6280 5696 Left 4 ;Offset
TEXT 8088 4480 Left 4 ;Feedback
TEXT 10192 4952 Left 4 ;Output Stage
TEXT 9120 5656 Left 4 ;Load DC
TEXT 9272 4472 Left 4 ;Current Source
TEXT 9312 5624 Left 4 ;Bias Generator
TEXT 9144 5696 Left 4 ;Offset

The netlist it stands for:
* paltkz - Copy.asc
V2 +60V 0 60
V3 0 -60V 60
Q65 N001 N004 N006 0 BC547C
R105 +15V N001 2020
R107 N009 N006 500
R108 N007 N009 500
Q80 +60V N015 N018 0 2N5550
Q81 +60V N018 N021 0 Qmj21194
Q82 +60V N021 N030 0 Qmj21194
Q83 +60V N021 N029 0 Qmj21194
Q84 +60V N021 N028 0 Qmj21194
Q85 -60V N043 N085 0 2N5401
Q86 -60V N085 N075 0 Qmj21193
Q87 -60V N075 N058 0 Qmj21193
Q88 -60V N075 N057 0 Qmj21193
Q89 -60V N075 N056 0 Qmj21193
R140 N028 Fourier_L 0.1
R141 Fourier_L N056 0.1
R142 N029 Fourier_L 0.1
R143 N030 Fourier_L 0.1
R144 Fourier_L N057 0.1
R145 Fourier_L N058 0.1
R146 N021 N075 180
R147 N018 N085 400
Q90 N039 N041 N043 0 BC547C
R148 N015 P001 1k5
R149 N041 N043 300
R150 N015 N039 1k
Q91 N043 N039 N015 0 BC857C
R151 N043 -60V 25k
Q92 N015 Current N010 0 2N5401
R153 +60V N010 100
Q93 +60V N021 N027 0 Qmj21194
Q94 +60V N021 N026 0 Qmj21194
Q95 -60V N075 N055 0 Qmj21193
Q96 -60V N075 N054 0 Qmj21193
R154 N026 Fourier_L 0.1
R155 Fourier_L N054 0.1
R156 N027 Fourier_L 0.1
R157 Fourier_L N055 0.1
Q97 +60V N021 N025 0 Qmj21194
Q98 -60V N075 N053 0 Qmj21193
R158 N025 Fourier_L 0.1
R159 Fourier_L N053 0.1
Q99 +60V N021 N024 0 Qmj21194
Q100 +60V N021 N023 0 Qmj21194
Q101 -60V N075 N052 0 Qmj21193
Q102 -60V N075 N051 0 Qmj21193
R160 N023 Fourier_L 0.1
R161 Fourier_L N051 0.1
R162 N024 Fourier_L 0.1
R163 Fourier_L N052 0.1
R164 +60V N067 24k
R165 N067 -60V 390
Q103 N043 N067 N077 0 QTIP41C
R166 N077 -60V 120
Q104 N043 Current N019 0 2SA1579
C17 N043 N045 1n Rser=0.1
V4 N003 0 Vi
C21 N004 N003 156n Rser=0.1
R173 N004 0 51k
R172 Fourier_R Fourier_L 8
D1 0 +15V BZX84C15VL
D2 -15V 0 BZX84C15VL
Q9 N009 N012 N013 0 BC547C
R30 N013 -15V 68
R28 +60V N019 100
C15 N067 N045 100µ Rser=0.1
R29 +60V N070 24k
R35 N070 -60V 390
Q2 N047 N070 N080 0 2N5550
R36 N080 -60V 120
R40 +60V N069 24k
R41 N069 -60V 390
Q4 N046 N069 N079 0 2N5550
R44 N079 -60V 120
R45 +60V N068 24k
R46 N068 -60V 390
Q6 N045 N068 N078 0 2N5550
R47 N078 -60V 120
R48 +60V N047 5900
R49 +60V N046 5900
R50 +60V N045 5900
C4 N046 N045 12n Rser=0.1
C5 N070 N001 1µ
C7 N069 N047 10µ
C11 N068 N046 15µ
R12 +60V N019 330
R§TRIM4 P001 N041 150
R21 P002 P003 55.7
R§TRIM6 P003 -60V 8
R1 -60V -15V 2k2
R2 +60V +15V 2k2
M2 N043 -60V P002 P002 NMOS
Q1 +60V N016 N020 0 2N5550
Q3 +60V N020 N022 0 Qmj21194
Q5 +60V N022 N031 0 Qmj21194
Q7 +60V N022 N032 0 Qmj21194
Q8 +60V N022 N033 0 Qmj21194
Q10 -60V N044 N086 0 2N5401
Q11 -60V N086 N076 0 Qmj21193
Q12 -60V N076 N059 0 Qmj21193
Q13 -60V N076 N060 0 Qmj21193
Q14 -60V N076 N061 0 Qmj21193
R3 N033 Fourier_R 0.1
R4 Fourier_R N061 0.1
R5 N032 Fourier_R 0.1
R6 N031 Fourier_R 0.1
R7 Fourier_R N060 0.1
R8 Fourier_R N059 0.1
R9 N022 N076 180
R10 N020 N086 390
Q15 N040 N042 N044 0 BC547C
R11 N016 P004 1k5
R13 N042 N044 300
R14 N016 N040 1k
Q16 N044 N040 N016 0 BC857C
Q17 N002 N005 N007 0 BC547C
R15 +15V N002 2020
R16 N044 -60V 25k
Q18 N016 Current N011 0 2N5401
R17 Current 0 3k3
D3 N008 Current 1N4148
D4 +60V N008 1N4148
R18 +60V N011 100
Q19 +60V N022 N034 0 Qmj21194
Q20 +60V N022 N035 0 Qmj21194
Q21 -60V N076 N062 0 Qmj21193
Q22 -60V N076 N063 0 Qmj21193
R19 N035 Fourier_R 0.1
R20 Fourier_R N063 0.1
R22 N034 Fourier_R 0.1
R23 Fourier_R N062 0.1
Q23 +60V N022 N036 0 Qmj21194
Q24 -60V N076 N064 0 Qmj21193
R24 N036 Fourier_R 0.1
R25 Fourier_R N064 0.1
Q25 +60V N022 N037 0 Qmj21194
Q26 +60V N022 N038 0 Qmj21194
Q27 -60V N076 N065 0 Qmj21193
Q28 -60V N076 N066 0 Qmj21193
R26 N038 Fourier_R 0.1
R27 Fourier_R N066 0.1
R31 N037 Fourier_R 0.1
R32 Fourier_R N065 0.1
R33 +60V N074 24k
R34 N074 -60V 390
Q29 N044 N074 N084 0 QTIP41C
R37 N084 -60V 120
Q30 N044 Current N017 0 2SA1579
R38 +60V N017 100
C1 N044 N050 1n Rser=0.1
D5 N014 -15V 1N4148
D6 N012 N014 1N4148
R39 +15V N012 5700
R42 +60V N071 24k
R43 N071 -60V 390
Q31 N048 N071 N081 0 2N5550
R51 N081 -60V 120
R52 +60V N072 24k
R53 N072 -60V 390
Q32 N049 N072 N082 0 2N5550
R54 N082 -60V 120
R55 +60V N073 24k
R56 N073 -60V 390
Q33 N050 N073 N083 0 2N5550
R57 N083 -60V 120
R58 Fourier_R N005 470k
R59 0 N005 4k7
R60 +60V N048 5900
R61 +60V N049 5900
R62 +60V N050 5900
C2 N049 N050 12n Rser=0.1
C3 N050 N074 100µ Rser=0.1
C6 N071 N002 1µ
C8 N072 N048 10µ
C9 N073 N049 15µ
R63 +60V N017 330
R§TRIM1 P004 N042 150
R64 P005 P006 56.4
R§TRIM2 P006 -60V 9
M1 N044 -60V P005 P005 NMOS
.model D D
.lib standard.dio
.model NPN NPN
.model PNP PNP
.lib standard.bjt
.model NMOS NMOS
.model PMOS PMOS
.lib standard.mos
* Voltage Source
* Voltage Amplifier Stage
* Input Stage
* Output Stage
* Load
* Current Source
* Bias Generator
* Load DC
* Offset
* Feedback
* Output Stage
* Load DC
* Current Source
* Bias Generator
* Offset
.backanno
.end